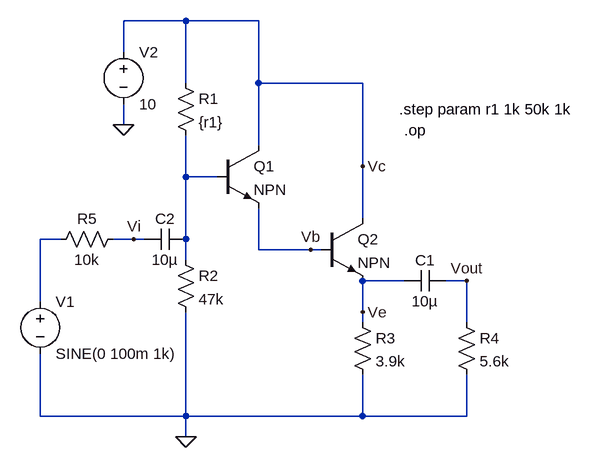
[diagram p0: schematic Draft1.asc]
Draft1.asc, the LTspice schematic file:
Version 4
SHEET 1 880 680
WIRE 80 -128 -16 -128
WIRE 192 -128 80 -128
WIRE -16 -80 -16 -128
WIRE 80 -32 80 -128
WIRE 192 -32 192 -128
WIRE 352 -32 192 -32
WIRE -16 32 -16 0
WIRE 192 64 192 -32
WIRE 352 96 352 -32
WIRE 80 112 80 48
WIRE 128 112 80 112
WIRE 352 176 352 96
WIRE -112 208 -144 208
WIRE 0 208 -32 208
WIRE 16 208 0 208
WIRE 80 208 80 112
WIRE 192 224 192 160
WIRE 272 224 192 224
WIRE 288 224 272 224
WIRE 80 240 80 208
WIRE 416 272 352 272
WIRE 512 272 480 272
WIRE -144 304 -144 208
WIRE 352 320 352 272
WIRE 352 336 352 320
WIRE 512 336 512 272
WIRE -144 480 -144 384
WIRE 80 480 80 320
WIRE 80 480 -144 480
WIRE 352 480 352 416
WIRE 352 480 80 480
WIRE 512 480 512 416
WIRE 512 480 352 480
WIRE 80 512 80 480
FLAG 80 512 0
FLAG -16 32 0
FLAG 352 96 Vc
FLAG 272 224 Vb
FLAG 352 320 Ve
FLAG 512 272 Vout
FLAG 0 208 Vi
SYMBOL npn 128 64 R0
WINDOW 0 56 32 Left 2
WINDOW 3 56 68 Left 2
SYMATTR InstName Q1
SYMBOL npn 288 176 R0
WINDOW 0 56 32 Left 2
WINDOW 3 56 68 Left 2
SYMATTR InstName Q2
SYMBOL voltage -144 288 R0
WINDOW 123 0 0 Left 0
WINDOW 39 0 0 Left 0
SYMATTR InstName V1
SYMATTR Value SINE(0 100m 1k)
SYMBOL voltage -16 -96 R0
WINDOW 123 0 0 Left 0
WINDOW 39 0 0 Left 0
SYMATTR InstName V2
SYMATTR Value 10
SYMBOL res 64 -48 R0
WINDOW 0 36 40 Left 2
WINDOW 3 36 76 Left 2
SYMATTR InstName R1
SYMATTR Value {r1}
SYMBOL res 64 224 R0
WINDOW 0 36 40 Left 2
WINDOW 3 36 76 Left 2
SYMATTR InstName R2
SYMATTR Value 47k
SYMBOL res 336 320 R0
WINDOW 0 36 40 Left 2
WINDOW 3 36 76 Left 2
SYMATTR InstName R3
SYMATTR Value 3.9k
SYMBOL res 496 320 R0
WINDOW 0 36 40 Left 2
WINDOW 3 36 76 Left 2
SYMATTR InstName R4
SYMATTR Value 5.6k
SYMBOL res -16 192 R90
WINDOW 0 0 56 VBottom 2
WINDOW 3 32 56 VTop 2
SYMATTR InstName R5
SYMATTR Value 10k
SYMBOL cap 480 256 R90
WINDOW 0 0 32 VBottom 2
WINDOW 3 32 32 VTop 2
SYMATTR InstName C1
SYMATTR Value 10µ
SYMBOL cap 80 192 R90
WINDOW 0 0 32 VBottom 2
WINDOW 3 32 32 VTop 2
SYMATTR InstName C2
SYMATTR Value 10µ
TEXT 408 8 Left 2 !.step param r1 1k 50k 1k
TEXT 416 40 Left 2 !.op

The netlist it stands for:
* Draft1.asc
Q1 Vc N001 Vb 0 NPN
Q2 Vc Vb Ve 0 NPN
V1 N002 0 SINE(0 100m 1k)
V2 Vc 0 10
R1 Vc N001 {r1}
R2 N001 0 47k
R3 Ve 0 3.9k
R4 Vout 0 5.6k
R5 Vi N002 10k
C1 Vout Ve 10µ
C2 N001 Vi 10µ
.model NPN NPN
.model PNP PNP
.lib standard.bjt
.step param r1 1k 50k 1k
.op
.backanno
.end

* Results of the author's LTspice run, read from the files saved beside the schematic
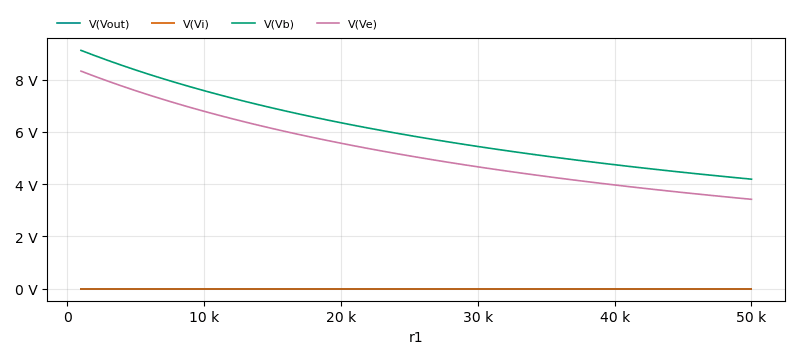
[diagram p1: Operating Point of Draft1.asc, plotted from the saved traces]
* Operating Point, 1 run:
*   V(Vout): 466.1 fV at r1=1 k, 191.6 fV at r1=50 k, min 191.6 fV, max 466.1 fV
*   V(Vi): 979.1 fV at r1=1 k, 484.3 fV at r1=50 k, min 484.3 fV, max 979.1 fV
*   V(Vb): 9.117 V at r1=1 k, 4.192 V at r1=50 k, min 4.192 V, max 9.117 V
*   V(Ve): 8.324 V at r1=1 k, 3.421 V at r1=50 k, min 3.421 V, max 8.324 V
* From the log:
*   Semiconductor Device Operating Points:
*                           --- Bipolar Transistors ---
*   Name:       q2          q1
*   Model:      npn         npn
*   Ib:       2.11e-05    2.09e-07
*   Ic:       2.11e-03    2.09e-05
*   Vbe:      7.94e-01    6.74e-01
*   Vbc:     -8.83e-01   -2.09e-01
*   Vce:      1.68e+00    8.83e-01
*   BetaDC:   1.00e+02    1.00e+02
*   Gm:       8.17e-02    8.09e-04
*   Rpi:      1.22e+03    1.24e+05
*   Rx:       0.00e+00    0.00e+00
*   Ro:       1.72e+29    8.21e+17
*   Cbe:      0.00e+00    0.00e+00
*   Cbc:      0.00e+00    0.00e+00
*   Cjs:      0.00e+00    0.00e+00
*   BetaAC:   1.00e+02    1.00e+02
*   Cbx:      0.00e+00    0.00e+00
*   Ft:       0.00e+00    0.00e+00